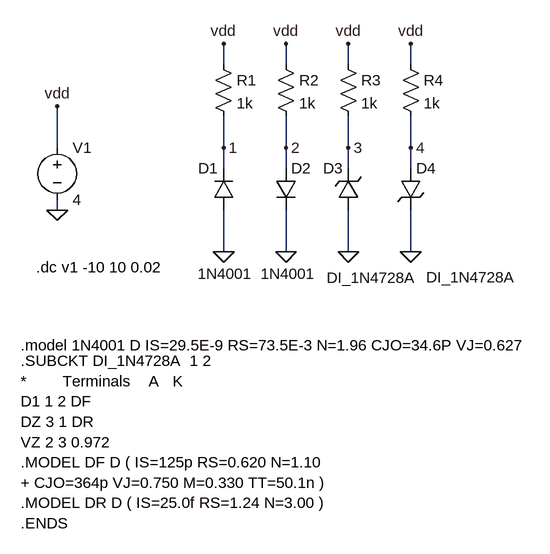
[diagram p0: schematic diodes_calısma.asc]
diodes_calısma.asc, the LTspice schematic file:
Version 4
SHEET 1 1508 764
WIRE 368 -16 368 -48
WIRE 464 -16 464 -48
WIRE 560 -16 560 -48
WIRE 656 -16 656 -48
WIRE 112 112 112 48
WIRE 368 112 368 64
WIRE 464 112 464 64
WIRE 560 112 560 64
WIRE 656 112 656 64
WIRE 368 144 368 112
WIRE 464 144 464 112
WIRE 560 144 560 112
WIRE 656 144 656 112
WIRE 112 208 112 192
WIRE 368 272 368 208
WIRE 464 272 464 208
WIRE 560 272 560 208
WIRE 656 272 656 208
FLAG 112 208 0
FLAG 368 -48 vdd
FLAG 112 48 vdd
FLAG 368 272 0
FLAG 560 -48 vdd
FLAG 560 272 0
FLAG 368 112 1
FLAG 560 112 3
FLAG 656 -48 vdd
FLAG 656 272 0
FLAG 656 112 4
FLAG 464 -48 vdd
FLAG 464 272 0
FLAG 464 112 2
SYMBOL voltage 112 96 R0
WINDOW 123 0 0 Left 0
WINDOW 39 0 0 Left 0
SYMATTR InstName V1
SYMATTR Value 4
SYMBOL res 352 -32 R0
SYMATTR InstName R1
SYMATTR Value 1k
SYMBOL diode 384 208 R180
WINDOW 0 24 64 Left 2
WINDOW 3 -29 -98 Left 2
SYMATTR InstName D1
SYMATTR Value 1N4001
SYMBOL zener 576 208 R180
WINDOW 0 24 64 Left 2
WINDOW 3 -89 -104 Left 2
SYMATTR InstName D3
SYMATTR Value DI_1N4728A
SYMBOL res 544 -32 R0
SYMATTR InstName R3
SYMATTR Value 1k
SYMBOL zener 640 144 R0
WINDOW 3 40 167 Left 2
SYMATTR InstName D4
SYMATTR Value DI_1N4728A
SYMBOL res 640 -32 R0
SYMATTR InstName R4
SYMATTR Value 1k
SYMBOL res 448 -32 R0
SYMATTR InstName R2
SYMATTR Value 1k
SYMBOL diode 448 144 R0
WINDOW 3 -23 162 Left 2
SYMATTR InstName D2
SYMATTR Value 1N4001
TEXT 80 296 Left 2 !.dc v1 -10 10 0.02
TEXT 56 440 Left 2 !.SUBCKT DI_1N4728A  1 2\n*        Terminals    A   K\nD1 1 2 DF\nDZ 3 1 DR\nVZ 2 3 0.972\n.MODEL DF D ( IS=125p RS=0.620 N=1.10\n+ CJO=364p VJ=0.750 M=0.330 TT=50.1n )\n.MODEL DR D ( IS=25.0f RS=1.24 N=3.00 )\n.ENDS
TEXT 56 416 Left 2 !.model 1N4001 D IS=29.5E-9 RS=73.5E-3 N=1.96 CJO=34.6P VJ=0.627

The netlist it stands for:
* diodes_calısma.asc
V1 vdd 0 4
R1 vdd 1 1k
D1 0 1 1N4001
D3 0 3 DI_1N4728A
R3 vdd 3 1k
D4 4 0 DI_1N4728A
R4 vdd 4 1k
R2 vdd 2 1k
D2 2 0 1N4001
.model D D
.lib standard.dio
.dc v1 -10 10 0.02
.SUBCKT DI_1N4728A  1 2
*        Terminals    A   K
D1 1 2 DF
DZ 3 1 DR
VZ 2 3 0.972
.MODEL DF D ( IS=125p RS=0.620 N=1.10
+ CJO=364p VJ=0.750 M=0.330 TT=50.1n )
.MODEL DR D ( IS=25.0f RS=1.24 N=3.00 )
.ENDS
.model 1N4001 D IS=29.5E-9 RS=73.5E-3 N=1.96 CJO=34.6P VJ=0.627
.backanno
.end